# EasyEDA Pro project KDT3ADDAMP-093三路加法器.eprj

# Schematic Schematic1
Create Date: 2023-10-20; Page Name: P1; Project Name: KDT3ADDAMP-093三路加法器; Schematic Name: Schematic1; Update Date: 2023-10-20; Company: 嘉立创EDA; Page Size: A4; Version: V1.0
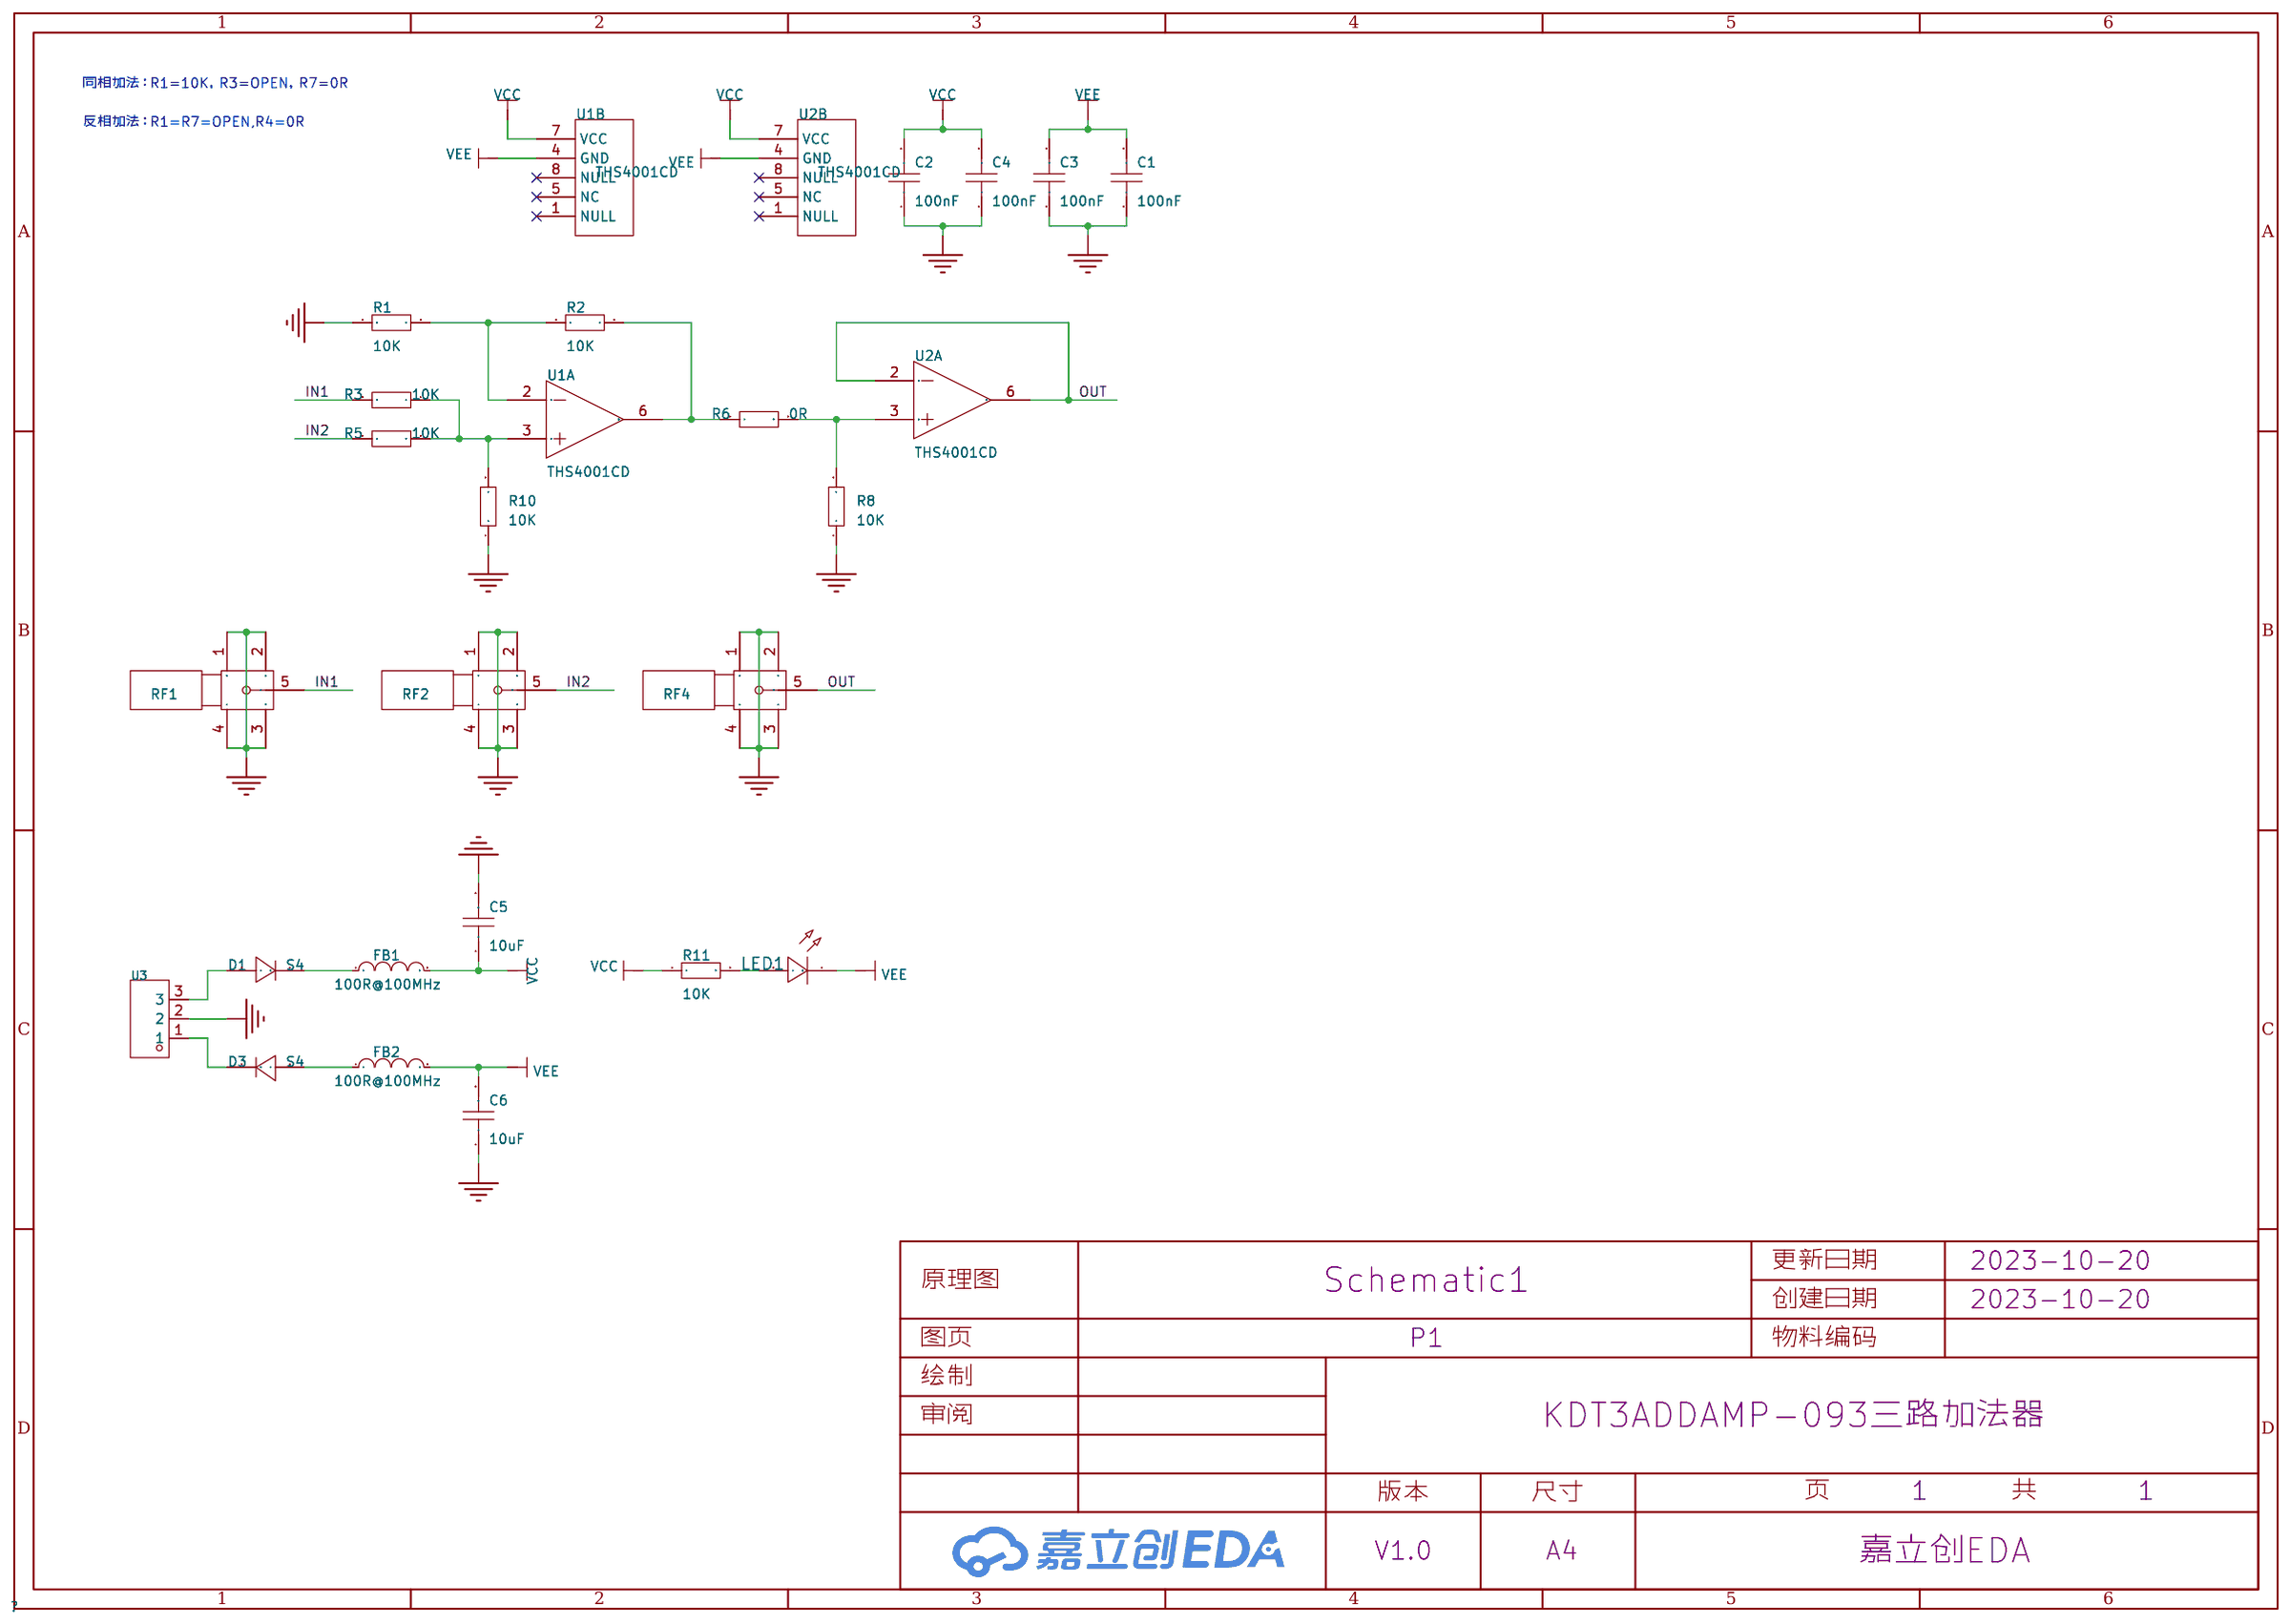
[diagram p0: schematic sheet]

## Parts
C1  100nF  [C0603]
C2  100nF  [C0603]
C3  100nF  [C0603]
C4  100nF  [C0603]
C5  10uF  [C1206]
C6  10uF  [C1206]
D1  S4  [SOD-323_L1.8-W1.3-LS2.5-RD]
D3  S4  [SOD-323_L1.8-W1.3-LS2.5-RD]
FB1  100R@100MHz  [L0603]
FB2  100R@100MHz  [L0603]
LED1  -  [LED_0603]
R1  10K  [R0603]
R2  10K  [R0603]
R3  10K  [R0603]
R5  10K  [R0603]
R6  0R  [R0603]
R8  10K  [R0603]
R10  10K  [R0603]
R11  10K  [R0603]
RF1  BWSMA-KE-P001  [SMA-SMD_BWSMA-KE-P001]
RF2  BWSMA-KE-P001  [SMA-SMD_BWSMA-KE-P001]
RF4  BWSMA-KE-P001  [SMA-SMD_BWSMA-KE-P001]
U1  THS4001CD  [SOIC-8_L5.0-W4.0-P1.27-LS6.0-BL]  (sections 1,2)
U2  THS4001CD  [SOIC-8_L5.0-W4.0-P1.27-LS6.0-BL]  (sections 1,2)
U3  HCZZ0126-3  [CONN-TH_3P-P2.50_3PIN]

## Library data of the parts
C1-C4 = CAP_0603: Supplier Footprint: 0603
C5 C6 = CAP_1206: Supplier Footprint: 1206
D1 D3 = SD103AWS_C8607: 直流反向耐压(Vr):40V;平均整流电流(Io):350mA;正向压降(Vf):600mV@200mA;; LCSC Part Name: SD103AWS S4; Supplier Part: C8607; Manufacturer: CJ(江苏长电/长晶); Supplier Footprint: SOD-323; JLCPCB Part Class: Extended Part; Datasheet: https://atta.szlcsc.com/upload/public/pdf/source/20140809/1457707216280.pdf; Supplier: LCSC; Reverse Voltage (Vr): 40V; Average Rectified Current (Io): 350mA; Forward Voltage (Vf@If): 600mV@200mA
FB1 FB2 = UPZ1608E101-3R0TF: 标称阻抗@测试频率:100Ω@100MHz;误差:±25%;直流电阻(RDC):30mΩ;额定电流:3A;电路数:1;; LCSC Part Name: 100Ω@100MHz ±25%; Supplier Part: C96995; Manufacturer: Sunlord(顺络); Supplier Footprint: 0603; JLCPCB Part Class: Extended Part; Datasheet: https://atta.szlcsc.com/upload/public/pdf/source/20210916/3C06D8971A361A4569490E57F6B8A429.pdf; Supplier: LCSC; Impedance @ Frequency: 100Ω@100MHz; Tolerance: ±25%; DC Resistance: 30mΩ; Current Rating: 3A; Circuits: 1
LED1 = LED_0603-R: Supplier Footprint: 0603
R1-R3 R5 R6 R8 R10 R11 = Res_0603: Supplier Footprint: 0603
RF1 RF2 RF4 = BWSMA-KE-P001: 连接器类型:板端;射频系列:SMA;接口类型:内孔;端口数量:1;阻抗:50Ω;频率-最大值:12.4GHz;样式:偏脚;接口直径:5.2mm;接口长度/高度:-;工作温度范围:-;; LCSC Part Name: SMA 内孔 偏脚 SMA偏脚板端座子; Supplier Part: C496550; Manufacturer: BAT WIRELESS(蝙蝠无线); Supplier Footprint: 插件; JLCPCB Part Class: Extended Part; Datasheet: https://atta.szlcsc.com/upload/public/pdf/source/20200416/C496550_06668BF2E3B968EA39F96D17E7156373.pdf; Supplier: LCSC; Connector Type: 板端; RF Series: SMA; Interface Type: 内孔; Number of Ports: 1; Impedance: 50Ω; Frequency-Max: 12.4GHz; Style: 偏脚; Interface Diameter: 5.2mm
U1 U2 = THS4001CD: 放大器组数:-;; Supplier Part: C527505; Manufacturer: TI(德州仪器); Supplier Footprint: SOIC-8; JLCPCB Part Class: 扩展库; Datasheet: https://atta.szlcsc.com/upload/public/pdf/source/20200507/C527505_4F34BBD5DFD4F26855D0FED31634306E.pdf; Supplier: LCSC
U3 = HCZZ0126-3: 参考系列:XH;间距:2.54mm;插针结构:1X3P;排数:1;每排PIN数:3;公母:母座;安装方式:直插;额定电流:3A;触头材质:黄铜;触头镀层:镀锡;工作温度范围:-25℃~+85℃;焊接温度(最大值):-;; LCSC Part Name: 系列:XH 间距:2.54mm 1X3P 直插; Supplier Part: C7433753; Manufacturer: HC(虹成电子); Supplier Footprint: 插件,P=2.54mm; JLCPCB Part Class: Extended Part; Datasheet: https://atta.szlcsc.com/upload/public/pdf/source/20230707/5BA1D5BA8108B3866C01EAB592CAE285.pdf; Supplier: LCSC; Reference Series: XH; Pitch: 2.54mm; Pins Structure: 1X3P; Number of Rows: 1; Number of PINs Per Row: 3; Gender: 母座; Mounting Style: 直插; Current Rating (Max): 3A; Contact Material: 黄铜; Contact Plating: 镀锡; Operating Temperature Range: -25℃~+85℃

## Nets
GND: C1.1 C2.1 C3.1 C4.1 C5.2 C6.1 R1.1 R8.1 R10.1 RF1.1 RF1.2 RF1.3 RF1.4 RF2.1 RF2.2 RF2.3 RF2.4 RF4.1 RF4.2 RF4.3 RF4.4 U3.2
VCC: C2.2 C4.2 C5.1 FB1.2 R11.1 U1.7(VCC) U2.7(VCC)
VEE: C1.2 C3.2 C6.2 FB2.2 LED1.1(C) U1.4(GND) U2.4(GND)
IN1: R3.2 RF1.5
IN2: R5.1 RF2.5
OUT: RF4.5 U2.2(IN-) U2.6(OUT)
$1N1085: R6.2 R8.2 U2.3(IN+)
$1N1092: R2.2 R6.1 U1.6(OUT)
$1N1809: D1.2(A) U3.3
$1N1814: D3.1(C) U3.1
$1N1822: D3.2(A) FB2.1
$1N1827: D1.1(C) FB1.1
Net-(LED1-2): LED1.2(A) R11.2
Net-(R1-2): R1.2 R2.1 U1.2(IN-)
Net-(R3-1): R3.1 R5.2 R10.2 U1.3(IN+)

Not connected (* = marked no-connect by the designer): U1 1(NULL)* 5(NC)* 8(NULL)*; U2 1(NULL)* 5(NC)* 8(NULL)*

## Notes on the sheet
- 同相加法：R1=10K，R3=OPEN，R7=0R
- 反相加法：R1=R7=OPEN,R4=0R

# Board PCB1
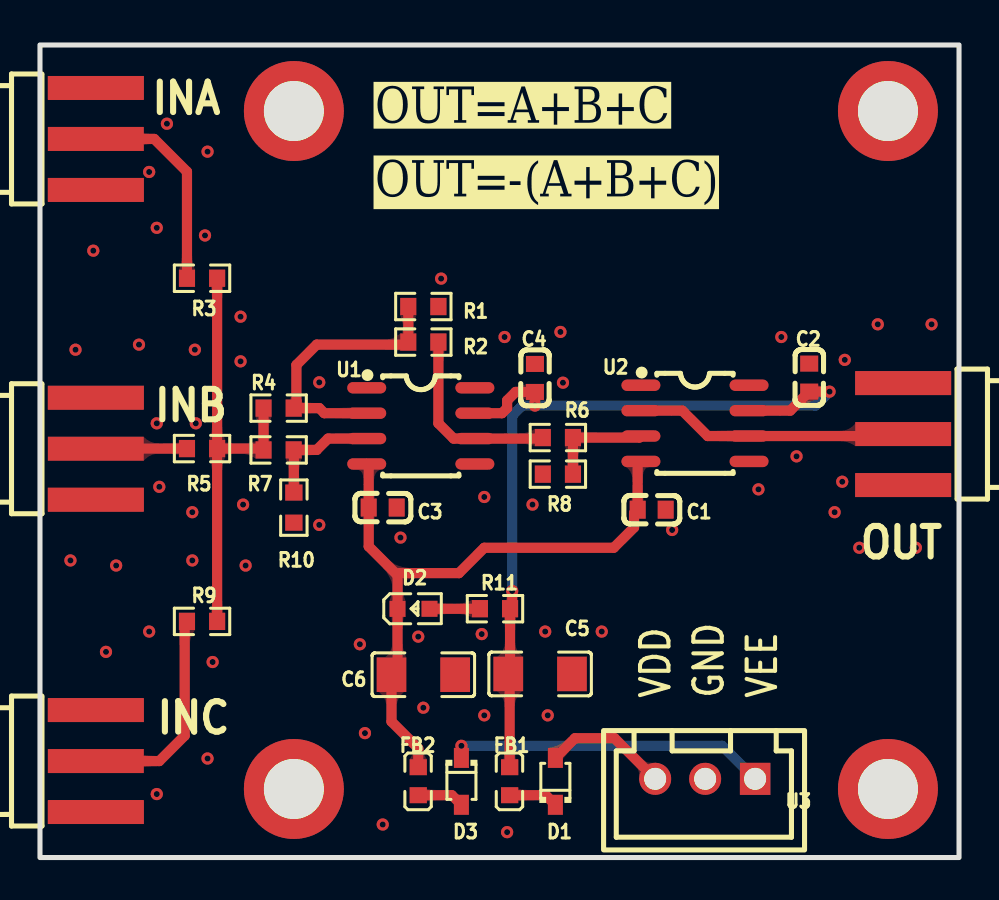
[diagram p1: board, top side]
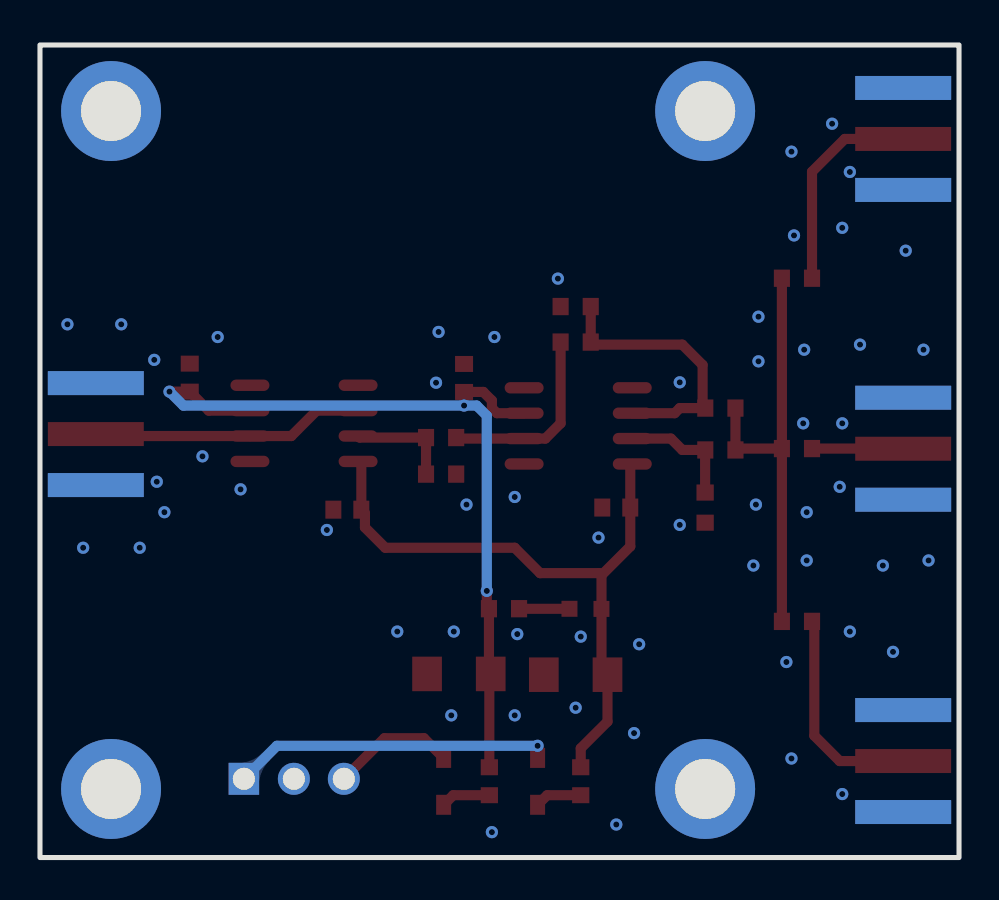
[diagram p2: board, bottom side, seen from below]

Outline 45.97 x 40.64 mm; copper layers: Top Layer, Bottom Layer. Coordinates in mm from the lower left corner of the outline.
Outline path: rectangle 0,40.64 45.97,0
Stack: Top Layer 0.035mm / Dielectric1 1.51mm FR4 er 4.5 / Bottom Layer 0.035mm

## Design rules (mm)
template: JLCPCB Capability(Two Layers Board)
spacing copperThickness1oz (default): track to track 0.102, other pairs 0.152 to 0.3
spacing copperThickness2oz: track to track 0.203, other pairs 0.152 to 0.3
track width copperThickness1oz (default): min 0.127, default 0.254, max 2.54
track width copperThickness2oz: min 0.203, default 0.254, max 2.54
differential pair differentialPair (default): width min 0.127, default 0.254, max 2.54; gap min 0.152, default 0.152
via viaSize (default): diameter min 0.5, default 0.61, max 10; hole min 0.3, default 0.305, max 6.3

## Placement (name value [footprint] x y rotation side)
C1  100nF  [C0603]  30.6 17.4 180 top
C2  100nF  [C0603]  38.48 24 270 top
C3  100nF  [C0603]  17.14 17.5 180 top
C4  100nF  [C0603]  24.76 23.99 270 top
C5  10uF  [C1206]  25.02 9.18 0 top
C6  10uF  [C1206]  19.18 9.14 180 top
D1  S4  [SOD-323_L1.8-W1.3-LS2.5-RD]  25.78 3.81 90 top
D2  -  [LED_0603]  18.74 12.45 0 top
D3  S4  [SOD-323_L1.8-W1.3-LS2.5-RD]  21.08 3.81 270 top
FB1  100R@100MHz  [L0603]  23.5 3.82 90 top
FB2  100R@100MHz  [L0603]  18.92 3.82 90 top
INA  BWSMA-KE-P001  [SMA-SMD_BWSMA-KE-P001]  2.79 35.94 180 top
INB  BWSMA-KE-P001  [SMA-SMD_BWSMA-KE-P001]  2.79 20.45 180 top
INC  BWSMA-KE-P001  [SMA-SMD_BWSMA-KE-P001]  2.79 4.83 180 top
NOREF  -  [Pad_e55]  42.42 3.43 0 top
NOREF#2  -  [Pad_e56]  12.7 3.43 0 top
NOREF#3  -  [Pad_e51]  12.7 37.34 0 top
NOREF#4  -  [Pad_e54]  42.42 37.34 0 top
OUT  BWSMA-KE-P001  [SMA-SMD_BWSMA-KE-P001]  43.18 21.18 0 top
R1  10K  [R0603]  19.18 27.56 180 top
R2  10K  [R0603]  19.18 25.78 0 top
R3  10K  [R0603]  8.11 28.97 180 top
R4  OPEN  [R0603]  11.94 22.48 0 top
R5  10K  [R0603]  8.11 20.45 0 top
R6  0R  [R0603]  25.91 21.01 0 top
R7  0R  [R0603]  11.94 20.39 0 top
R8  10K  [R0603]  25.91 19.18 0 top
R9  10K  [R0603]  8.11 11.81 0 top
R10  10K  [R0603]  12.7 17.5 90 top
R11  10K  [R0603]  22.76 12.45 180 top
U1  THS4001CD  [SOIC-8_L5.0-W4.0-P1.27-LS6.0-BL]  19.05 21.59 270 top
U2  THS4001CD  [SOIC-8_L5.0-W4.0-P1.27-LS6.0-BL]  32.77 21.72 270 top
U3  HCZZ0126-3  [CONN-TH_3P-P2.50_3PIN]  33.27 3.94 180 top

## Footprints (pads in the part's own frame, mm; a bottom-side part is the same pattern mirrored in y, then rotated)
C0603
  rect 0.8x0.9 smd: 1(-0.7,0) 2(0.7,0)
C1206
  rect 1.485x1.728 smd: 1(-1.593,0) 2(1.593,0)
CONN-TH_3P-P2.50_3PIN
  rect 1.524x1.6 hole 1.1: 1(-2.5,0)
  round 1.6 hole 1.1: 2(0,0) 3(2.5,0)
L0603
  rect 0.8x0.864 smd: 1(-0.7,0) 2(0.7,0)
LED_0603
  rect 0.8x0.8 smd: 1(-0.851,-0.01) 2(0.75,-0.005)
Pad_e51
  oval 5x5 hole 3: 9(0,0)
Pad_e54
  oval 5x5 hole 3: 9(0,0)
Pad_e55
  oval 5x5 hole 3: 9(0,0)
Pad_e56
  oval 5x5 hole 3: 9(0,0)
R0603
  rect 0.806x0.864 smd: 1(-0.753,0) 2(0.753,0)
SMA-SMD_BWSMA-KE-P001
  rect 4.8x1.2 smd: 1(0,-2.55) 2(0,2.55) 5(0,0)
  rect 4.8x1.2 smd far side: 3(0,2.55) 4(0,-2.55)
SOD-323_L1.8-W1.3-LS2.5-RD
  rect 1x0.75 smd: 1(-1.173,0) 2(1.173,0)
SOIC-8_L5.0-W4.0-P1.27-LS6.0-BL
  oval 0.569x1.95 smd: 1(-1.905,-2.705) 2(-0.635,-2.705) 3(0.635,-2.705) 4(1.905,-2.705) 5(1.905,2.705) 6(0.635,2.705) 7(-0.635,2.705) 8(-1.905,2.705)

## Nets
GND: C1.1 C2.1 C3.1 C4.1 C5.2 C6.1 INA.1 INA.2 INA.3 INA.4 INB.1 INB.2 INB.3 INB.4 INC.1 INC.2 INC.3 INC.4 NOREF.9 NOREF#2.9 NOREF#3.9 NOREF#4.9 OUT.1 OUT.2 OUT.3 OUT.4 R1.1 R8.1 R10.1 U3.2
VCC: C2.2 C4.2 C5.1 FB1.2 R11.1 U1.7 U2.7
VEE: C1.2 C3.2 C6.2 D2.1 FB2.2 U1.4 U2.4
IN1: INA.5 R3.2
IN2: INB.5 R5.1
IN3: INC.5 R9.1
OUT: OUT.5 U2.2 U2.6
$1N981: R7.2 R10.2 U1.3
$1N1020: R3.1 R4.1 R5.2 R7.1 R9.2
$1N1063: R1.2 R2.1 R4.2 U1.2
$1N1085: R6.2 R8.2 U2.3
$1N1092: R2.2 R6.1 U1.6
$1N1809: D1.2 U3.3
$1N1814: D3.1 U3.1
$1N1822: D3.2 FB2.1
$1N1827: D1.1 FB1.1
$1N2129: D2.2 R11.2

Pads without a net: U1 1 5 8; U2 1 5 8

## Via types
v1: diameter 0.61, hole 0.305, Top Layer to Bottom Layer, 60 vias

## Routing (per net, layer and track width the routed paths; a pad name or vN(x,y) marks a point on that pad's centre or on a via; arc(x,y) is an arc through that point)
GND:
  vias: v1(1.52,14.86) v1(1.78,25.4) v1(2.67,30.35) v1(3.3,10.29) v1(3.81,14.6) v1(4.95,25.65) v1(5.46,34.29) v1(5.46,11.3) v1(5.84,31.5) v1(5.84,21.72) v1(5.84,3.17) v1(5.97,18.54) v1(6.35,36.7) v1(7.62,17.27) v1(7.62,14.86) v1(7.75,25.4) v1(7.8,21.72) v1(8.25,31.11) v1(8.38,35.31) v1(8.38,4.95) v1(8.64,9.78) v1(10.03,27.05) v1(10.03,24.82) v1(10.16,17.65) v1(10.29,14.6) v1(13.97,23.77) v1(13.97,16.64) v1(16,10.67) v1(16.26,6.22) v1(17.14,1.65) v1(18.03,16) v1(18.92,11.05) v1(19.18,7.49) v1(20.07,28.96) v1(22.1,11.18) v1(22.22,18.03) v1(22.22,7.11) v1(23.24,26.03) v1(23.37,1.27) v1(24.64,17.65) v1(25.27,11.3) v1(25.4,7.11) v1(26.03,26.29) v1(26.16,23.75) v1(28.1,11.3) v1(31.62,16.38) v1(35.94,18.41) v1(37.08,26.03) v1(37.85,20.07) v1(39.75,17.27) v1(40.13,18.8) v1(40.26,24.89) v1(40.98,15.49) v1(41.91,26.67) v1(43.81,15.49) v1(44.6,26.67)
VCC: length 42.8
  Top Layer w0.508: v1(39.5,23.3) C2.2 37.53,22.35 U2.7 ; v1(23.62,13.33) 23.62,12.55 R11.1 23.51,9.27 C5.1 23.5,9.11 FB1.2 ; U1.7 23.11,22.22 23.37,22.48 23.37,22.86 23.8,23.29 C4.2 v1(24.76,22.61)
  Bottom Layer w0.508: v1(23.62,13.33) 23.62,22.1 24.13,22.61 v1(24.76,22.61) 38.8,22.61 v1(39.5,23.3)
VEE: length 32.8
  Top Layer w0.508: U2.4 29.9,19.65 C1.2 29.72,17.22 29.72,16.51 28.7,15.49 22.22,15.49 20.95,14.22 17.99,14.22 17.89,14.12 ; 17.89,14.12 16.44,15.56 C3.2 16.44,19.58 U1.4 ; 17.89,14.12 D2.1 17.89,9.44 C6.2 17.58,6.8 18.92,5.46 FB2.2
IN1: length 11.3
  Top Layer w0.508: 2.03,35.94 5.72,35.94 7.35,34.3 R3.2
IN2: length 5.1
  Top Layer w0.508: R5.1 2.29,20.45 2.29,20.45
IN3: length 11.5
  Top Layer w0.508: 2.03,4.83 5.97,4.83 7.24,6.1 7.24,11.7 R9.1
OUT: length 14.7
  Top Layer w0.508: 44.2,21.18 44.1,21.08 U2.6 33.4,21.08 32.13,22.35 U2.2
$1N981: length 6
  Top Layer w0.508: R10.2 12.7,20.38 R7.2 13.84,20.39 14.41,20.95 16.34,20.95
$1N1020: length 21.6
  Top Layer w0.508: R3.1 R5.2 ; R5.2 11.12,20.45 R7.1 R4.1 ; R5.2 R9.2
$1N1063: length 13.8
  Top Layer w0.508: U1.2 14.22,22.22 13.97,22.48 R4.2 12.83,22.61 12.83,24.64 13.84,25.65 18.3,25.65 R2.1 R1.2
$1N1085: length 5.3
  Top Layer w0.508: R8.2 R6.2 29.98,21.01 U2.3
$1N1092: length 9.6
  Top Layer w0.508: R6.1 25.1,20.95 20.69,20.95 19.93,21.72 R2.2
$1N1809: length 6.2
  Top Layer w0.508: D1.2 26.77,5.97 28.74,5.97 U3.3
$1N1814: length 16
  Top Layer w0.508: D3.1 v1(21.08,5.59)
  Bottom Layer w0.508: U3.1 34.12,5.59 v1(21.08,5.59)
$1N1822: length 2.4
  Top Layer w0.508: FB2.1 20.6,3.12 D3.2
$1N1827: length 2.5
  Top Layer w0.508: FB1.1 25.3,3.12 D1.1
$1N2129: length 2.5
  Top Layer w0.508: R11.2 22,12.44 19.49,12.44

## Copper pours and planes (outline as drawn; the poured copper is in the pictures)
GND on Top Layer: -1.52,41.15 47.24,41.15 47.24,-0.25 -1.52,-0.25
GND on Bottom Layer: -2.54,41.66 48.77,41.66 48.77,-1.27 -2.54,-1.27

Small or netless copper shapes (teardrops, artwork), in the pictures only: 64 on Top Layer, 1 on Bottom Layer

## Text on the board
Top Silkscreen Layer: VDD | GND | VEE | OUT=A+B+C | OUT=-(A+B+C)
